# EasyEDA schematic CANageddonBus.json
TITLE: CANageddonBus; REV: 1.1; Date: 2023-01-16; Sheet: 1/1; Company: FRC #4855 Ramageddon
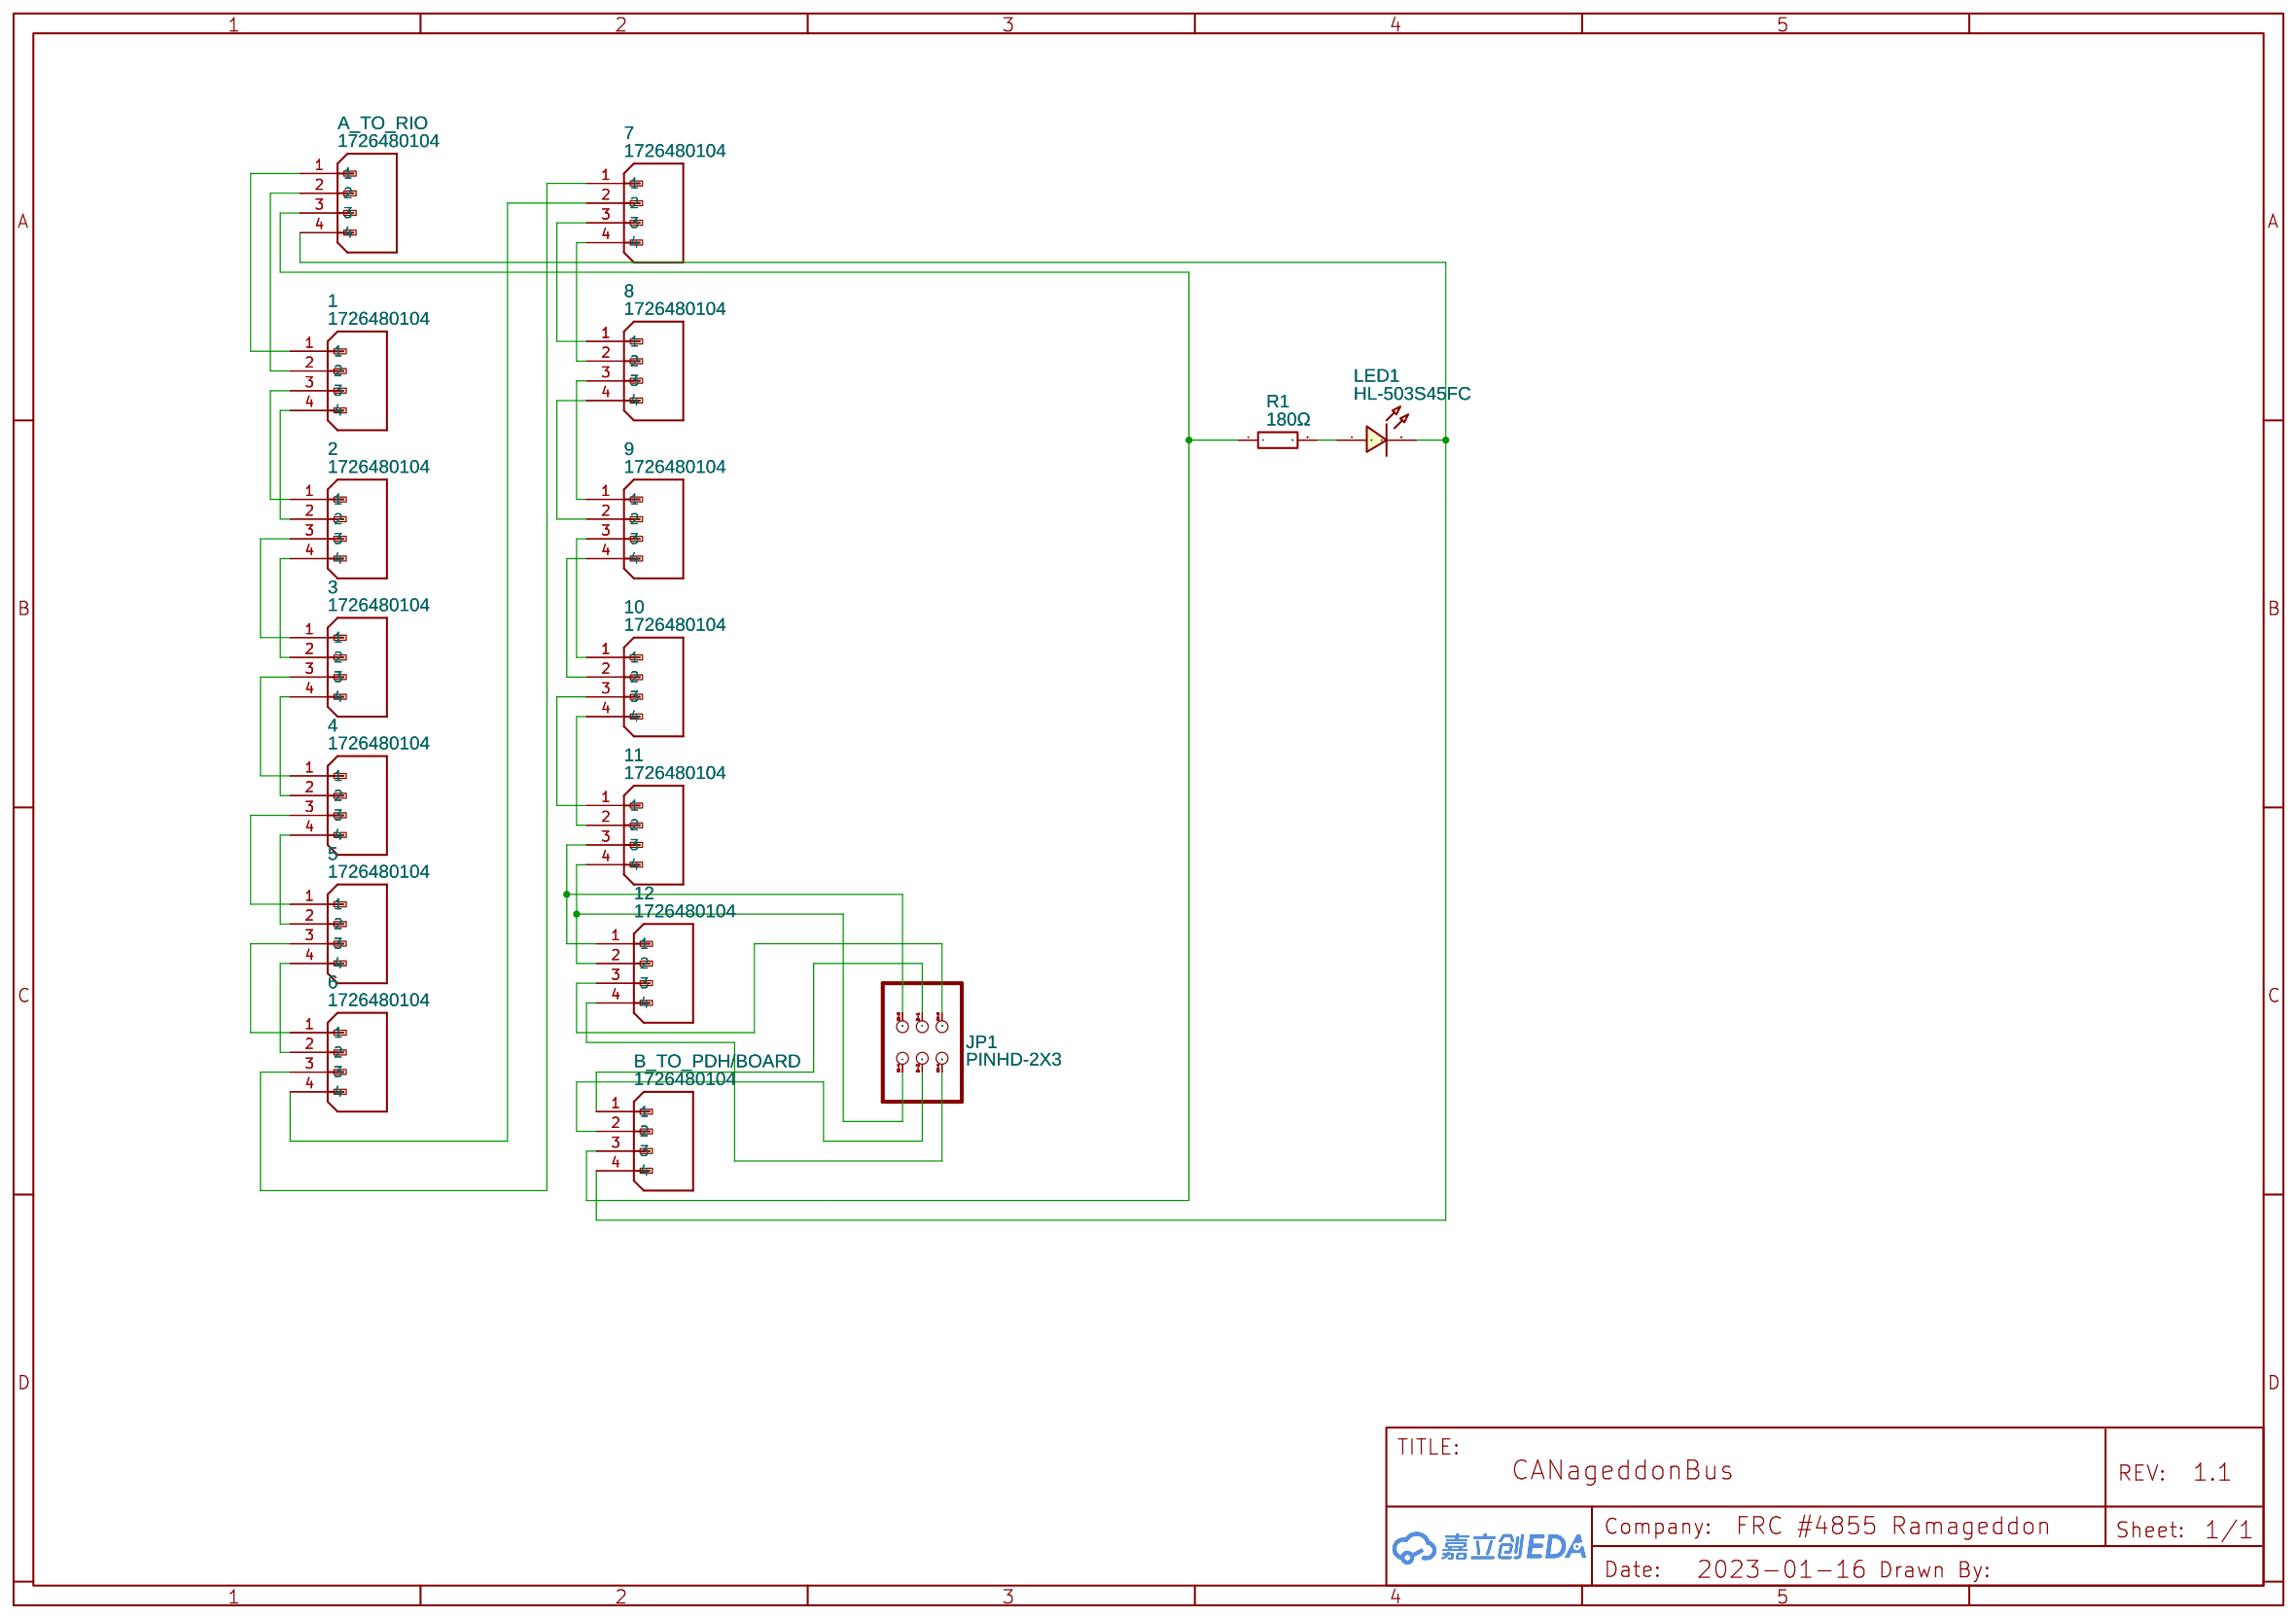
[diagram p0: schematic sheet]

## Parts
1  1726480104  [MOLEX_1726480104]
2  1726480104  [MOLEX_1726480104]
3  1726480104  [MOLEX_1726480104]
4  1726480104  [MOLEX_1726480104]
5  1726480104  [MOLEX_1726480104]
6  1726480104  [MOLEX_1726480104]
7  1726480104  [MOLEX_1726480104]
8  1726480104  [MOLEX_1726480104]
9  1726480104  [MOLEX_1726480104]
10  1726480104  [MOLEX_1726480104]
11  1726480104  [MOLEX_1726480104]
12  1726480104  [MOLEX_1726480104]
A_TO_RIO  1726480104  [MOLEX_1726480104]
B_TO_PDH/BOARD  1726480104  [MOLEX_1726480104]
JP1  PINHD-2X3  [2X03]
LED1  HL-503S45FC  [LED-TH_BD5.0-P2.54-FD]
R1  180Ω  [RES-TH_BD2.5-L6.5-P10.50-D0.6]

## Library data of the parts
1-12 A_TO_RIO B_TO_PDH/BOARD = 1726480104: Contributor: cheeseshark
JP1 = PINHD-2X3: Contributor: SparkFun
LED1 = HL-503S45FC: Supplier: LCSC; Supplier Part: C568942; Manufacturer: HONGLITRONIC(鸿利光电); Contributor: LCSC; JLCPCB Part Class: Extended Part
R1 = MFR0W4F1800A50: Supplier: LCSC; Manufacturer: UNI-ROYAL(厚声); Supplier Part: C58665; Resistance (Ohms): 180; JLCPCB Part Class: Extended Part

## Nets
Net-(1-1): 1.1 A_TO_RIO.1
Net-(1-2): 1.2 A_TO_RIO.2
Net-(1-3): 1.3 2.1
Net-(1-4): 1.4 2.2
Net-(2-3): 2.3 3.1
Net-(2-4): 2.4 3.2
Net-(3-3): 3.3 4.1
Net-(3-4): 3.4 4.2
Net-(4-3): 4.3 5.1
Net-(4-4): 4.4 5.2
Net-(5-3): 5.3 6.1
Net-(5-4): 5.4 6.2
Net-(6-3): 6.3 7.1
Net-(6-4): 6.4 7.2
Net-(7-3): 7.3 8.1
Net-(7-4): 7.4 8.2
Net-(8-3): 8.3 9.1
Net-(8-4): 8.4 9.2
Net-(9-3): 9.3 10.1
Net-(9-4): 9.4 10.2
Net-(10-3): 10.3 11.1
Net-(10-4): 10.4 11.2
Net-(11-3): 11.3 12.1 JP1.11-3(2)
Net-(11-4): 11.4 12.2 JP1.11-4(1)
Net-(12-3): 12.3 JP1.12-3(6)
Net-(12-4): 12.4 JP1.12-4(5)
Net-(A_TO_RIO-3): A_TO_RIO.3 B_TO_PDH/BOARD.3 R1.1
Net-(A_TO_RIO-4): A_TO_RIO.4 B_TO_PDH/BOARD.4 LED1.2
Net-(B_TO_PDH/BOARD-1): B_TO_PDH/BOARD.1 JP1.B-1(4)
Net-(B_TO_PDH/BOARD-2): B_TO_PDH/BOARD.2 JP1.B-2(3)
Net-(LED1-1): LED1.1 R1.2
